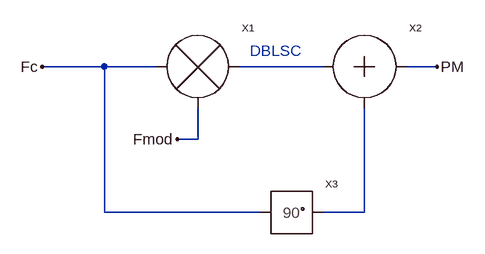
[diagram p0: schematic armstrongModelo.asc]
armstrongModelo.asc, the LTspice schematic file:
Version 4
SHEET 1 880 680
WIRE -48 128 -144 128
WIRE 48 128 -48 128
WIRE 288 128 144 128
WIRE 464 128 416 128
WIRE 96 240 96 192
WIRE 96 240 64 240
WIRE -48 352 -48 128
WIRE 192 352 -48 352
WIRE 352 352 352 192
WIRE 352 352 288 352
FLAG 64 240 Fmod
FLAG -144 128 Fc
FLAG 464 128 PM
SYMBOL adder 352 128 R0
SYMATTR InstName X2
SYMBOL mixer 96 128 R0
SYMATTR InstName X1
SYMBOL delay 240 352 R0
SYMATTR InstName X3
TEXT 176 104 Left 2 ;DBLSC

The netlist it stands for:
* armstrongModelo.asc
XX2 adder
XX1 mixer
XX3 delay
* DBLSC
.backanno
.end